# Altium schematic sheet MCU_System.SchDoc
size A
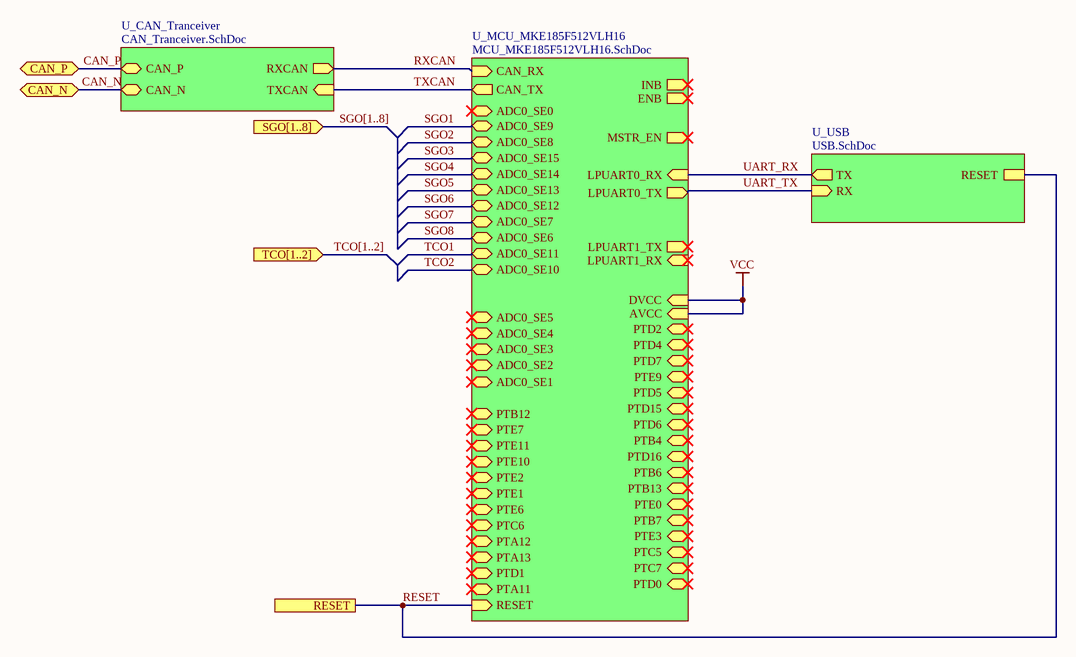
[diagram p0: MCU_System.SchDoc]

## Sub-sheets
U_CAN_Tranceiver = CAN_Tranceiver.SchDoc: TXCAN (in), RXCAN (out), CAN_P (bidir), CAN_N (bidir)
U_MCU_MKE185F512VLH16 = MCU_MKE185F512VLH16.SchDoc: CAN_TX (out), CAN_RX (in), INB (out), ENB (out), ADC0_SE11 (bidir), ADC0_SE10 (bidir), ADC0_SE9 (bidir), ADC0_SE8 (bidir), ADC0_SE15 (bidir), ADC0_SE14 (bidir), ADC0_SE13 (bidir), ADC0_SE12 (bidir), ADC0_SE7 (bidir), ADC0_SE6 (bidir), ADC0_SE1 (bidir), ADC0_SE0 (bidir), LPUART0_TX (out), LPUART0_RX (in), MSTR_EN (out), ADC0_SE5 (bidir), ADC0_SE4 (bidir), LPUART1_TX (out), LPUART1_RX (in), ADC0_SE3 (bidir), ADC0_SE2 (bidir), DVCC (in), AVCC (in), RESET (in), PTD2 (bidir), PTD4 (bidir), PTD7 (bidir), PTE9 (bidir), PTD5 (bidir), PTD15 (bidir), PTD6 (bidir), PTB4 (bidir), PTD16 (bidir), PTB6 (bidir), PTB13 (bidir), PTE0 (bidir), PTB7 (bidir), PTE3 (bidir), PTC5 (bidir), PTC7 (bidir), PTD0 (bidir), PTB12 (bidir), PTE7 (bidir), PTE11 (bidir), PTE10 (bidir), PTE2 (bidir), PTE1 (bidir), PTE6 (bidir), PTC6 (bidir), PTA12 (bidir), PTA13 (bidir), PTD1 (bidir), PTA11 (bidir)
U_USB = USB.SchDoc: TX (out), RX (in), RESET

## Ports
CAN_N (bidir), CAN_P (bidir), RESET, SGO[1..8] (in), TCO[1..2] (in)

## Nets
VCC: sheet U_MCU_MKE185F512VLH16/DVCC, sheet U_MCU_MKE185F512VLH16/AVCC
CAN_N: port CAN_N, sheet U_CAN_Tranceiver/CAN_N
CAN_P: port CAN_P, sheet U_CAN_Tranceiver/CAN_P
RESET: port RESET, sheet U_USB/RESET, sheet U_MCU_MKE185F512VLH16/RESET
RXCAN: sheet U_CAN_Tranceiver/RXCAN, sheet U_MCU_MKE185F512VLH16/CAN_RX
SGO1: sheet U_MCU_MKE185F512VLH16/ADC0_SE9
SGO2: sheet U_MCU_MKE185F512VLH16/ADC0_SE8
SGO3: sheet U_MCU_MKE185F512VLH16/ADC0_SE15
SGO4: sheet U_MCU_MKE185F512VLH16/ADC0_SE14
SGO5: sheet U_MCU_MKE185F512VLH16/ADC0_SE13
SGO6: sheet U_MCU_MKE185F512VLH16/ADC0_SE12
SGO7: sheet U_MCU_MKE185F512VLH16/ADC0_SE7
SGO8: sheet U_MCU_MKE185F512VLH16/ADC0_SE6
TCO1: sheet U_MCU_MKE185F512VLH16/ADC0_SE11
TCO2: sheet U_MCU_MKE185F512VLH16/ADC0_SE10
TXCAN: sheet U_CAN_Tranceiver/TXCAN, sheet U_MCU_MKE185F512VLH16/CAN_TX
UART_RX: sheet U_USB/TX, sheet U_MCU_MKE185F512VLH16/LPUART0_RX
UART_TX: sheet U_USB/RX, sheet U_MCU_MKE185F512VLH16/LPUART0_TX

## Buses and harness runs
bus SGO[1..8] = port SGO[1..8]
bus TCO[1..2] = port TCO[1..2]